# Altium schematic sheet jtag_levelxlate.SchDoc: JTAG and Level Translation
size A3; Date: DO NOT USE, RATHER USE PROJ OPTIONS; DrawnBy: DO NOT USE, RATHER USE PROJ OPTIONS; Engineer: DO NOT USE, RATHER USE PROJ OPTIONS; Organization: DO NOT USE, RATHER USE PROJ OPTIONS; DocumentNumber: DO NOT USE, RATHER USE PROJ OPTIONS; Revision: DO NOT USE, RATHER USE PROJ OPTIONS; SheetNumber: 26; SheetTotal: 27; SCH_Sheet_Filename: jtag_levelxlate.SchDoc; CurrentTime: DO NOT USE, RATHER USE PROJ OPTIONS; Time: DO NOT USE, RATHER USE PROJ OPTIONS; DocumentFullPathAndName: DO NOT USE, RATHER USE PROJ OPTIONS; DocumentName: DO NOT USE, RATHER USE PROJ OPTIONS; ModifiedDate: DO NOT USE, RATHER USE PROJ OPTIONS; ImagePath: DO NOT USE, RATHER USE PROJ OPTIONS
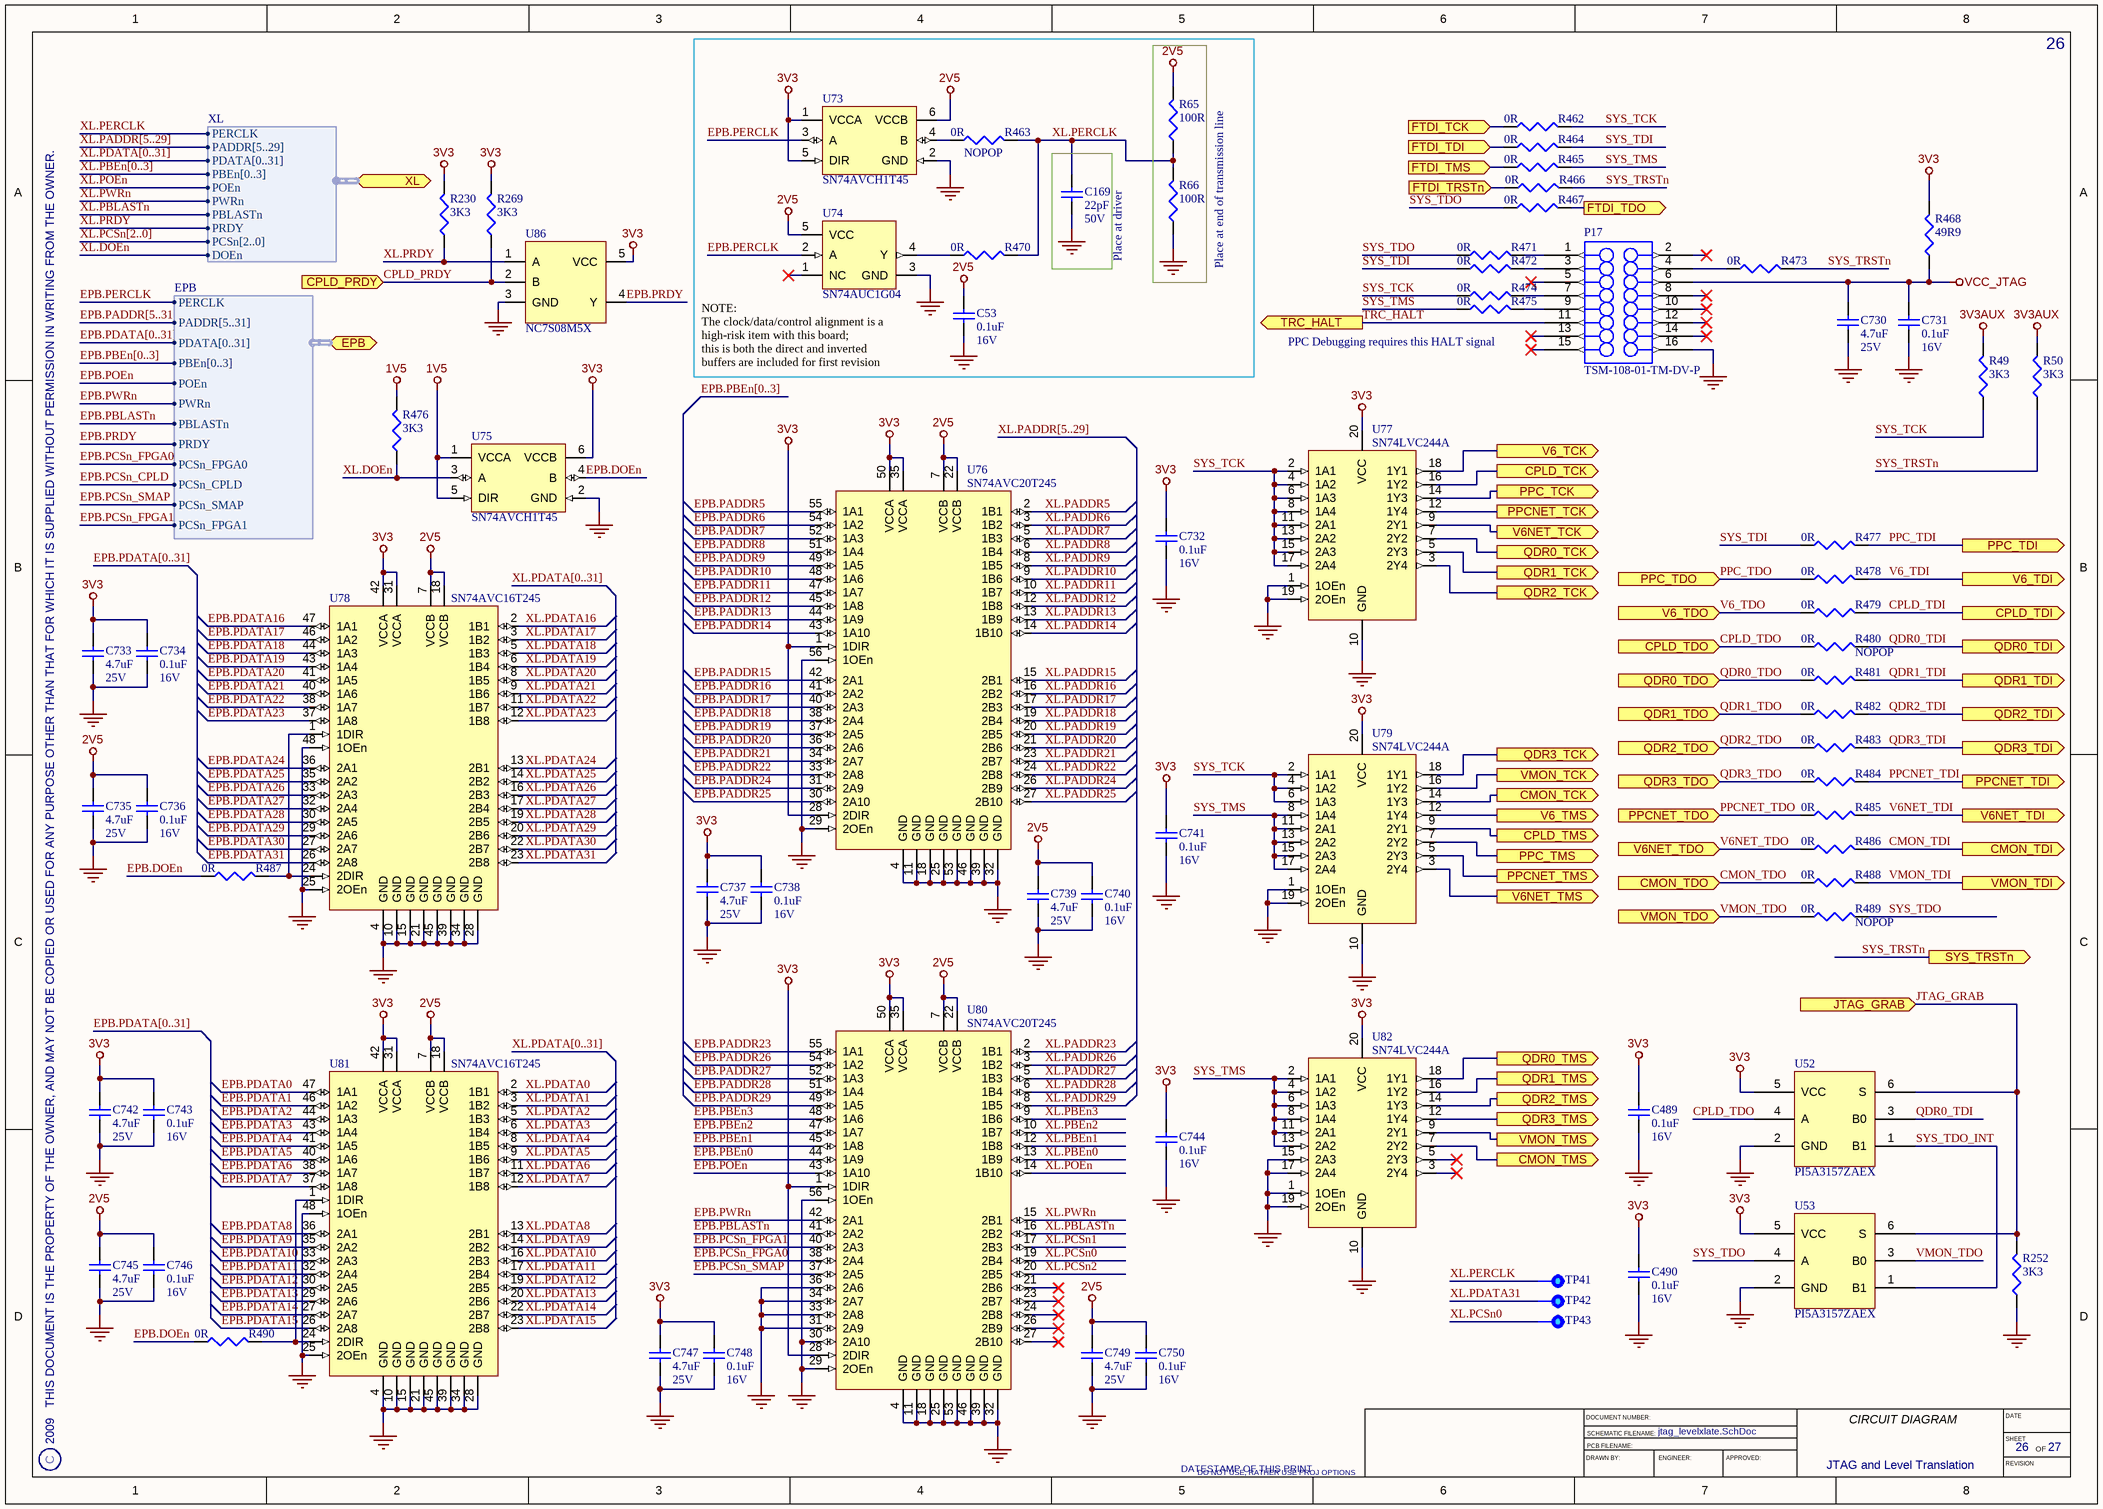
[diagram p0: jtag_levelxlate.SchDoc]

## Parts
C53  Rating: 16V  [CAPC1005X60L]  (hidden comment: 0.1uF)
C169  Rating: 50V  [CAPC1005X55L]  (hidden comment: 22pF)
C489  Rating: 16V  [CAPC1005X60L]  (hidden comment: 0.1uF)
C490  Rating: 16V  [CAPC1005X60L]  (hidden comment: 0.1uF)
C730  Rating: 25V  [CAPC2012X127L]  (hidden comment: 4.7uF)
C731  Rating: 16V  [CAPC1005X60L]  (hidden comment: 0.1uF)
C732  Rating: 16V  [CAPC1005X60L]  (hidden comment: 0.1uF)
C733  Rating: 25V  [CAPC2012X127L]  (hidden comment: 4.7uF)
C734  Rating: 16V  [CAPC1005X60L]  (hidden comment: 0.1uF)
C735  Rating: 25V  [CAPC2012X127L]  (hidden comment: 4.7uF)
C736  Rating: 16V  [CAPC1005X60L]  (hidden comment: 0.1uF)
C737  Rating: 25V  [CAPC2012X127L]  (hidden comment: 4.7uF)
C738  Rating: 16V  [CAPC1005X60L]  (hidden comment: 0.1uF)
C739  Rating: 25V  [CAPC2012X127L]  (hidden comment: 4.7uF)
C740  Rating: 16V  [CAPC1005X60L]  (hidden comment: 0.1uF)
C741  Rating: 16V  [CAPC1005X60L]  (hidden comment: 0.1uF)
C742  Rating: 25V  [CAPC2012X127L]  (hidden comment: 4.7uF)
C743  Rating: 16V  [CAPC1005X60L]  (hidden comment: 0.1uF)
C744  Rating: 16V  [CAPC1005X60L]  (hidden comment: 0.1uF)
C745  Rating: 25V  [CAPC2012X127L]  (hidden comment: 4.7uF)
C746  Rating: 16V  [CAPC1005X60L]  (hidden comment: 0.1uF)
C747  Rating: 25V  [CAPC2012X127L]  (hidden comment: 4.7uF)
C748  Rating: 16V  [CAPC1005X60L]  (hidden comment: 0.1uF)
C749  Rating: 25V  [CAPC2012X127L]  (hidden comment: 4.7uF)
C750  Rating: 16V  [CAPC1005X60L]  (hidden comment: 0.1uF)
P17  TSM-108-01-TM-DV-P  [SAMTEC_TSM-108-01-TM-DV-P]
R49  3K3  [RESC1005X40L]
R50  3K3  [RESC1005X40L]
R65  100R  [RESC1005X40L]
R66  100R  [RESC1005X40L]
R230  3K3  [RESC1005X40L]
R252  3K3  [RESC1005X40L]
R269  3K3  [RESC1005X40L]
R462  0R  [RESC1005X40L]
R463  0R  [RESC1005X40L]
R464  0R  [RESC1005X40L]
R465  0R  [RESC1005X40L]
R466  0R  [RESC1005X40L]
R467  0R  [RESC1005X40L]
R468  49R9  [RESC1005X40L]
R470  0R  [RESC1005X40L]
R471  0R  [RESC1005X40L]
R472  0R  [RESC1005X40L]
R473  0R  [RESC1005X40L]
R474  0R  [RESC1005X40L]
R475  0R  [RESC1005X40L]
R476  3K3  [RESC1005X40L]
R477  0R  [RESC1005X40L]
R478  0R  [RESC1005X40L]
R479  0R  [RESC1005X40L]
R480  0R  [RESC1005X40L]
R481  0R  [RESC1005X40L]
R482  0R  [RESC1005X40L]
R483  0R  [RESC1005X40L]
R484  0R  [RESC1005X40L]
R485  0R  [RESC1005X40L]
R486  0R  [RESC1005X40L]
R487  0R  [RESC1005X40L]
R488  0R  [RESC1005X40L]
R489  0R  [RESC1005X40L]
R490  0R  [RESC1005X40L]
TP41  Testpoint  [TP100]  (value not drawn)  (no BOM)
TP42  Testpoint  [TP100]  (value not drawn)  (no BOM)
TP43  Testpoint  [TP100]  (value not drawn)  (no BOM)
U52  PI5A3157ZAEX  [SC70-6]
U53  PI5A3157ZAEX  [SC70-6]
U73  SN74AVCH1T45  [SOT23-6]
U74  SN74AUC1G04  [SOT23-5]
U75  SN74AVCH1T45  [SOT23-6]
U76  SN74AVC20T245  [PW056]
U77  SN74LVC244A  [PW020]
U78  SN74AVC16T245  [PW048]
U79  SN74LVC244A  [PW020]
U80  SN74AVC20T245  [PW056]
U81  SN74AVC16T245  [PW048]
U82  SN74LVC244A  [PW020]
U86  NC7S08M5X  [SOT23-5]

## Ports
CMON_TCK (out), CMON_TDI (out), CMON_TDO (in), CMON_TMS (out), CPLD_PRDY (in), CPLD_TCK (out), CPLD_TDI (out), CPLD_TDO (in), CPLD_TMS (out), EPB (harness EPB), FTDI_TCK (in), FTDI_TDI (in), FTDI_TDO (out), FTDI_TMS (in), FTDI_TRSTn (in), JTAG_GRAB (in), PPC_TCK (out), PPC_TDI (out), PPC_TDO (in), PPC_TMS (out), PPCNET_TCK (out), PPCNET_TDI (out), PPCNET_TDO (in), PPCNET_TMS (out), QDR0_TCK (out), QDR0_TDI (out), QDR0_TDO (in), QDR0_TMS (out), QDR1_TCK (out), QDR1_TDI (out), QDR1_TDO (in), QDR1_TMS (out), QDR2_TCK (out), QDR2_TDI (out), QDR2_TDO (in), QDR2_TMS (out), QDR3_TCK (out), QDR3_TDI (out), QDR3_TDO (in), QDR3_TMS (out), SYS_TRSTn (out), TRC_HALT (out), V6_TCK (out), V6_TDI (out), V6_TDO (in), V6_TMS (out), V6NET_TCK (out), V6NET_TDI (out), V6NET_TDO (in), V6NET_TMS (out), VMON_TCK (out), VMON_TDI (out), VMON_TDO (in), VMON_TMS (out), XL (harness XL)

## Harnesses
EPB: PERCLK, PADDR[5..31], PDATA[0..31], PBEn[0..3], POEn, PWRn, PBLASTn, PRDY, PCSn_FPGA0, PCSn_CPLD, PCSn_SMAP, PCSn_FPGA1
XL: PERCLK, PADDR[5..29], PDATA[0..31], PBEn[0..3], POEn, PWRn, PBLASTn, PRDY, PCSn[2..0], DOEn

## Nets
1V5: R476.2 U75.1(VCCA) U75.5(DIR)
2V5: C53.2 C735.2 C736.2 C739.2 C740.2 C745.2 C746.2 C749.2 C750.2 R65.2 U73.6(VCCB) U74.5(VCC) U76.7(VCCB) U76.22(VCCB) U78.7(VCCB) U78.18(VCCB) U80.7(VCCB) U80.22(VCCB) U81.7(VCCB) U81.18(VCCB)
3V3: C489.2 C490.2 C732.2 C733.2 C734.2 C737.2 C738.2 C741.2 C742.2 C743.2 C744.2 C747.2 C748.2 R230.2 R269.2 R468.2 U52.5(VCC) U53.5(VCC) U73.1(VCCA) U73.5(DIR) U75.6(VCCB) U76.1(1DIR) U76.28(2DIR) U76.35(VCCA) U76.50(VCCA) U77.20(VCC) U78.31(VCCA) U78.42(VCCA) U79.20(VCC) U80.1(1DIR) U80.28(2DIR) U80.35(VCCA) U80.50(VCCA) U81.31(VCCA) U81.42(VCCA) U82.20(VCC) U86.5(VCC)
3V3AUX: R49.2 R50.2
GND: C53.1 C169.1 C489.1 C490.1 C730.1 C731.1 C732.1 C733.1 C734.1 C735.1 C736.1 C737.1 C738.1 C739.1 C740.1 C741.1 C742.1 C743.1 C744.1 C745.1 C746.1 C747.1 C748.1 C749.1 C750.1 P17.16(B16) R66.1 R252.1 U52.2(GND) U53.2(GND) U73.2(GND) U74.3(GND) U75.2(GND) U76.4(GND) U76.11(GND) U76.18(GND) U76.25(GND) U76.29(2OEn) U76.32(GND) U76.39(GND) U76.46(GND) U76.53(GND) U76.56(1OEn) U77.1(1OEn) U77.10(GND) U77.19(2OEn) U78.4(GND) U78.10(GND) U78.15(GND) U78.21(GND) U78.25(2OEn) U78.28(GND) U78.34(GND) U78.39(GND) U78.45(GND) U78.48(1OEn) U79.1(1OEn) U79.10(GND) U79.19(2OEn) U80.4(GND) U80.11(GND) U80.18(GND) U80.25(GND) U80.29(2OEn) U80.30(2A10) U80.31(2A9) U80.32(GND) U80.33(2A8) U80.34(2A7) U80.36(2A6) U80.39(GND) U80.46(GND) U80.53(GND) U80.56(1OEn) U81.4(GND) U81.10(GND) U81.15(GND) U81.21(GND) U81.25(2OEn) U81.28(GND) U81.34(GND) U81.39(GND) U81.45(GND) U81.48(1OEn) U82.1(1OEn) U82.10(GND) U82.15(2A3) U82.17(2A4) U82.19(2OEn) U86.3(GND)
VCC_JTAG: C730.2 C731.2 P17.6(B6) R468.1
CMON_TCK: U79.14(1Y3) ; port CMON_TCK
CMON_TDI: R486.2 ; port CMON_TDI
CMON_TDO: R488.1 ; port CMON_TDO
CMON_TMS: U82.7(2Y2) ; port CMON_TMS
CPLD_PRDY: R269.1 U86.2(B) ; port CPLD_PRDY
CPLD_TCK: U77.16(1Y2) ; port CPLD_TCK
CPLD_TDI: R479.2 ; port CPLD_TDI
CPLD_TDO: R480.1 U52.4(A) ; port CPLD_TDO
CPLD_TMS: U79.9(2Y1) ; port CPLD_TMS
EPB.DOEn: R487.1 R490.1 U75.4(B)
EPB.PADDR5: U76.55(1A1)
EPB.PADDR6: U76.54(1A2)
EPB.PADDR7: U76.52(1A3)
EPB.PADDR8: U76.51(1A4)
EPB.PADDR9: U76.49(1A5)
EPB.PADDR10: U76.48(1A6)
EPB.PADDR11: U76.47(1A7)
EPB.PADDR12: U76.45(1A8)
EPB.PADDR13: U76.44(1A9)
EPB.PADDR14: U76.43(1A10)
EPB.PADDR15: U76.42(2A1)
EPB.PADDR16: U76.41(2A2)
EPB.PADDR17: U76.40(2A3)
EPB.PADDR18: U76.38(2A4)
EPB.PADDR19: U76.37(2A5)
EPB.PADDR20: U76.36(2A6)
EPB.PADDR21: U76.34(2A7)
EPB.PADDR22: U76.33(2A8)
EPB.PADDR23: U80.55(1A1)
EPB.PADDR24: U76.31(2A9)
EPB.PADDR25: U76.30(2A10)
EPB.PADDR26: U80.54(1A2)
EPB.PADDR27: U80.52(1A3)
EPB.PADDR28: U80.51(1A4)
EPB.PADDR29: U80.49(1A5)
EPB.PBEn0: U80.44(1A9)
EPB.PBEn1: U80.45(1A8)
EPB.PBEn2: U80.47(1A7)
EPB.PBEn3: U80.48(1A6)
EPB.PBLASTn: U80.41(2A2) ; port EPB.PBLASTn
EPB.PCSn_CPLD: port EPB.PCSn_CPLD
EPB.PCSn_FPGA0: U80.38(2A4) ; port EPB.PCSn_FPGA0
EPB.PCSn_FPGA1: U80.40(2A3) ; port EPB.PCSn_FPGA1
EPB.PCSn_SMAP: U80.37(2A5) ; port EPB.PCSn_SMAP
EPB.PDATA0: U81.47(1A1)
EPB.PDATA1: U81.46(1A2)
EPB.PDATA2: U81.44(1A3)
EPB.PDATA3: U81.43(1A4)
EPB.PDATA4: U81.41(1A5)
EPB.PDATA5: U81.40(1A6)
EPB.PDATA6: U81.38(1A7)
EPB.PDATA7: U81.37(1A8)
EPB.PDATA8: U81.36(2A1)
EPB.PDATA9: U81.35(2A2)
EPB.PDATA10: U81.33(2A3)
EPB.PDATA11: U81.32(2A4)
EPB.PDATA12: U81.30(2A5)
EPB.PDATA13: U81.29(2A6)
EPB.PDATA14: U81.27(2A7)
EPB.PDATA15: U81.26(2A8)
EPB.PDATA16: U78.47(1A1)
EPB.PDATA17: U78.46(1A2)
EPB.PDATA18: U78.44(1A3)
EPB.PDATA19: U78.43(1A4)
EPB.PDATA20: U78.41(1A5)
EPB.PDATA21: U78.40(1A6)
EPB.PDATA22: U78.38(1A7)
EPB.PDATA23: U78.37(1A8)
EPB.PDATA24: U78.36(2A1)
EPB.PDATA25: U78.35(2A2)
EPB.PDATA26: U78.33(2A3)
EPB.PDATA27: U78.32(2A4)
EPB.PDATA28: U78.30(2A5)
EPB.PDATA29: U78.29(2A6)
EPB.PDATA30: U78.27(2A7)
EPB.PDATA31: U78.26(2A8)
EPB.PERCLK: U73.3(A) U74.2(A) ; port EPB.PERCLK
EPB.POEn: U80.43(1A10) ; port EPB.POEn
EPB.PRDY: U86.4(Y) ; port EPB.PRDY
EPB.PWRn: U80.42(2A1) ; port EPB.PWRn
FTDI_TCK: R462.1 ; port FTDI_TCK
FTDI_TDI: R464.1 ; port FTDI_TDI
FTDI_TDO: R467.2 ; port FTDI_TDO
FTDI_TMS: R465.1 ; port FTDI_TMS
FTDI_TRSTn: R466.1 ; port FTDI_TRSTn
JTAG_GRAB: R252.2 U52.6(S) U53.6(S) ; port JTAG_GRAB
PPC_TCK: U77.14(1Y3) ; port PPC_TCK
PPC_TDI: R477.2 ; port PPC_TDI
PPC_TDO: R478.1 ; port PPC_TDO
PPC_TMS: U79.7(2Y2) ; port PPC_TMS
PPCNET_TCK: U77.12(1Y4) ; port PPCNET_TCK
PPCNET_TDI: R484.2 ; port PPCNET_TDI
PPCNET_TDO: R485.1 ; port PPCNET_TDO
PPCNET_TMS: U79.5(2Y3) ; port PPCNET_TMS
QDR0_TCK: U77.7(2Y2) ; port QDR0_TCK
QDR0_TDI: R480.2 U52.3(B0) ; port QDR0_TDI
QDR0_TDO: R481.1 ; port QDR0_TDO
QDR0_TMS: U82.18(1Y1) ; port QDR0_TMS
QDR1_TCK: U77.5(2Y3) ; port QDR1_TCK
QDR1_TDI: R481.2 ; port QDR1_TDI
QDR1_TDO: R482.1 ; port QDR1_TDO
QDR1_TMS: U82.16(1Y2) ; port QDR1_TMS
QDR2_TCK: U77.3(2Y4) ; port QDR2_TCK
QDR2_TDI: R482.2 ; port QDR2_TDI
QDR2_TDO: R483.1 ; port QDR2_TDO
QDR2_TMS: U82.14(1Y3) ; port QDR2_TMS
QDR3_TCK: U79.18(1Y1) ; port QDR3_TCK
QDR3_TDI: R483.2 ; port QDR3_TDI
QDR3_TDO: R484.1 ; port QDR3_TDO
QDR3_TMS: U82.12(1Y4) ; port QDR3_TMS
SYS_TCK: R49.1 R462.2 R474.1 U77.2(1A1) U77.4(1A2) U77.6(1A3) U77.8(1A4) U77.11(2A1) U77.13(2A2) U77.15(2A3) U77.17(2A4) U79.2(1A1) U79.4(1A2) U79.6(1A3)
SYS_TDI: R464.2 R472.1 R477.1
SYS_TDO: R467.1 R471.1 R489.2 U53.4(A)
SYS_TDO_INT: U52.1(B1) U53.1(B1)
SYS_TMS: R465.2 R475.1 U79.8(1A4) U79.11(2A1) U79.13(2A2) U79.15(2A3) U79.17(2A4) U82.2(1A1) U82.4(1A2) U82.6(1A3) U82.8(1A4) U82.11(2A1) U82.13(2A2)
SYS_TRSTn: R50.1 R466.2 R473.2 ; port SYS_TRSTn
TRC_HALT: P17.11(A11) ; port TRC_HALT
V6_TCK: U77.18(1Y1) ; port V6_TCK
V6_TDI: R478.2 ; port V6_TDI
V6_TDO: R479.1 ; port V6_TDO
V6_TMS: U79.12(1Y4) ; port V6_TMS
V6NET_TCK: U77.9(2Y1) ; port V6NET_TCK
V6NET_TDI: R485.2 ; port V6NET_TDI
V6NET_TDO: R486.1 ; port V6NET_TDO
V6NET_TMS: U79.3(2Y4) ; port V6NET_TMS
VMON_TCK: U79.16(1Y2) ; port VMON_TCK
VMON_TDI: R488.2 ; port VMON_TDI
VMON_TDO: R489.1 U53.3(B0) ; port VMON_TDO
VMON_TMS: U82.9(2Y1) ; port VMON_TMS
XL.DOEn: R476.1 U75.3(A) ; port XL.DOEn
XL.PADDR5: U76.2(1B1)
XL.PADDR6: U76.3(1B2)
XL.PADDR7: U76.5(1B3)
XL.PADDR8: U76.6(1B4)
XL.PADDR9: U76.8(1B5)
XL.PADDR10: U76.9(1B6)
XL.PADDR11: U76.10(1B7)
XL.PADDR12: U76.12(1B8)
XL.PADDR13: U76.13(1B9)
XL.PADDR14: U76.14(1B10)
XL.PADDR15: U76.15(2B1)
XL.PADDR16: U76.16(2B2)
XL.PADDR17: U76.17(2B3)
XL.PADDR18: U76.19(2B4)
XL.PADDR19: U76.20(2B5)
XL.PADDR20: U76.21(2B6)
XL.PADDR21: U76.23(2B7)
XL.PADDR22: U76.24(2B8)
XL.PADDR23: U80.2(1B1)
XL.PADDR24: U76.26(2B9)
XL.PADDR25: U76.27(2B10)
XL.PADDR26: U80.3(1B2)
XL.PADDR27: U80.5(1B3)
XL.PADDR28: U80.6(1B4)
XL.PADDR29: U80.8(1B5)
XL.PBEn0: U80.13(1B9)
XL.PBEn1: U80.12(1B8)
XL.PBEn2: U80.10(1B7)
XL.PBEn3: U80.9(1B6)
XL.PBLASTn: U80.16(2B2) ; port XL.PBLASTn
XL.PCSn0: TP43.1 U80.19(2B4)
XL.PCSn1: U80.17(2B3)
XL.PCSn2: U80.20(2B5)
XL.PDATA0: U81.2(1B1)
XL.PDATA1: U81.3(1B2)
XL.PDATA2: U81.5(1B3)
XL.PDATA3: U81.6(1B4)
XL.PDATA4: U81.8(1B5)
XL.PDATA5: U81.9(1B6)
XL.PDATA6: U81.11(1B7)
XL.PDATA7: U81.12(1B8)
XL.PDATA8: U81.13(2B1)
XL.PDATA9: U81.14(2B2)
XL.PDATA10: U81.16(2B3)
XL.PDATA11: U81.17(2B4)
XL.PDATA12: U81.19(2B5)
XL.PDATA13: U81.20(2B6)
XL.PDATA14: U81.22(2B7)
XL.PDATA15: U81.23(2B8)
XL.PDATA16: U78.2(1B1)
XL.PDATA17: U78.3(1B2)
XL.PDATA18: U78.5(1B3)
XL.PDATA19: U78.6(1B4)
XL.PDATA20: U78.8(1B5)
XL.PDATA21: U78.9(1B6)
XL.PDATA22: U78.11(1B7)
XL.PDATA23: U78.12(1B8)
XL.PDATA24: U78.13(2B1)
XL.PDATA25: U78.14(2B2)
XL.PDATA26: U78.16(2B3)
XL.PDATA27: U78.17(2B4)
XL.PDATA28: U78.19(2B5)
XL.PDATA29: U78.20(2B6)
XL.PDATA30: U78.22(2B7)
XL.PDATA31: TP42.1 U78.23(2B8)
XL.PERCLK: C169.2 R65.1 R66.2 R463.2 R470.2 TP41.1 ; port XL.PERCLK
XL.POEn: U80.14(1B10) ; port XL.POEn
XL.PRDY: R230.1 U86.1(A) ; port XL.PRDY
XL.PWRn: U80.15(2B1) ; port XL.PWRn
NetP17_1: P17.1(A1) R471.2
NetP17_3: P17.3(A3) R472.2
NetP17_4: P17.4(B4) R473.1
NetP17_7: P17.7(A7) R474.2
NetP17_9: P17.9(A9) R475.2
NetR463_1: R463.1 U73.4(B)
NetR470_1: R470.1 U74.4(Y)
NetR487_2: R487.2 U78.1(1DIR) U78.24(2DIR)
NetR490_2: R490.2 U81.1(1DIR) U81.24(2DIR)

Not connected (* = marked no-connect by the designer): P17 2(B2)* 5(A5)* 8(B8)* 10(B10)* 12(B12)* 13(A13)* 14(B14)* 15(A15)*; U74 1(NC)*; U80 21(2B6)* 23(2B7)* 24(2B8)* 26(2B9)* 27(2B10)*; U82 3(2Y4)* 5(2Y3)*

## Buses and harness runs
bus EPB.PADDR[5..31]
bus EPB.PBEn[0..3]
bus EPB.PDATA[0..31]
bus XL.PADDR[5..29]
bus XL.PBEn[0..3]
bus XL.PCSn[2..0]
bus XL.PDATA[0..31]

## Notes on the sheet
- (near R463) NOPOP
- Place at driver
- Place at end of transmission line
- (near U74) NOTE:
  The clock/data/control alignment is a
  high-risk item with this board;
  this is both the direct and inverted
  buffers are included for first revision
- PPC Debugging requires this HALT signal
- (near R480) NOPOP
- (near R489) NOPOP
- 2009   THIS DOCUMENT IS THE PROPERTY OF THE OWNER, AND MAY NOT BE COPIED OR USED FOR ANY PURPOSE OTHER THAN THAT FOR WHICH IT IS SUPPLIED WITHOUT PERMISSION IN WRITING FROM THE OWNER.
- C
- DATESTAMP OF THIS PRINT
- DRAWN BY:
- DOCUMENT NUMBER:
- SCHEMATIC FILENAME:
- PCB FILENAME:
- ENGINEER:
- APPROVED:
- CIRCUIT DIAGRAM
- DATE
- SHEET
- REVISION
- OF

## Library data of the parts
C53 C489 C490 C731 C732 C734 C736 C738 C740 C741 C743 C744 C746 C748 C750 = CAP-CER-1: 0.1uF, Ceramic Capacitor; Manufacturer: VENKEL; PartNum: C0402X7R160-104KN; Tolerance: 10%; Dielectric: X7R; POD number: CAP-CER-1; Value: 0.1uF; RoHS: Y; Sort Value: 0.1; Category: Capacitors; Subcategory: Ceramic
C169 = CAP-CER-2: 22pF, Ceramic Capacitor; Manufacturer: MURATA; PartNum: GRM1555C1H220JZ01D; Tolerance: 5%; Dielectric: C0G; POD number: CAP-CER-2; Value: 22pF; RoHS: Y; Sort Value: 0.000022; Category: Capacitors; Subcategory: Ceramic
C730 C733 C735 C737 C739 C742 C745 C747 C749 = CAP-CER-3: 4.7uF, Ceramic Capacitor; Manufacturer: MURATA; PartNum: GRM21BR61E475KA12K; Tolerance: 10%; Dielectric: X5R; POD number: CAP-CER-3; Value: 4.7uF; RoHS: Y; Sort Value: 4.7; Category: Capacitors; Subcategory: Ceramic
P17 = CONN-PCB-11: 2x8, 2.54 mm Pitch, Male Header; Manufacturer: SAMTEC; POD number: CONN-PCB-11; PartNum: TSM-108-01-TM-DV-P; RoHS: Y; Category: CONN; Subcategory: PCB
R49 R50 R230 R252 R269 R476 = RES-TF-7: 3K3, 1.1mm x 0.5mm, Thick Film Resistor; Manufacturer: ROYALOHM; PartNum: 0402WGJ0332T1E; Tolerance: 5%; Rating: 0.0625W; POD number: RES-TF-7; Value: 3K3; Sort Value: 3300; Category: Resistors; Subcategory: ThickFilm; HelpURL: *.pdf
R65 R66 = RES-TF-14: 100R, 1.1mm x 0.5mm, Thick Film Resistor; Manufacturer: ROYALOHM; PartNum: 0402WGF0101T1E; Tolerance: 1%; Rating: 0.0625W; POD number: RES-TF-14; Value: 100R; Sort Value: 100; Category: Resistors; Subcategory: ThickFilm; HelpURL: http://www.royalohm.com/pdf/general.pdf
R462-R467 R470-R475 R477-R490 = RES-TF-0: 0R, 1.1mm x 0.5mm, Thick Film Resistor; Manufacturer: ROYALOHM; PartNum: 0402WG00000T1E; Tolerance: 0%; Rating: 0.0625W; POD number: RES-TF-0; Value: 0R; Sort Value: 0; Category: Resistors; Subcategory: ThickFilm; HelpURL: *.pdf
R468 = RES-TF-10: 49R9, 1.1mm x 0.5mm, Thick Film Resistor; Manufacturer: ROYALOHM; PartNum: 0402WGF499JT1E; Tolerance: 1%; Rating: 0.0625W; POD number: RES-TF-10; Value: 49R9; Sort Value: 49.9; Category: Resistors; Subcategory: ThickFilm; HelpURL: *.pdf
TP41-TP43 = ELMECH-TP-0: 1mm Diameter, through-hole, Circular Test-point; POD number: ELMECH-TP-0; RoHS: Y; Category: ELMECH; Subcategory: Test Points
U52 U53 = IC-LOG-5: Low voltage SPDT Analogue Switch; Manufacturer: PERICOM; POD number: IC-LOG-5; PartNum: PI5A3157ZAEX; RoHS: Y; Category: IC; Subcategory: Logic
U73 U75 = IC-LOG-13: Single-Bit Dual Supply Bus Transceiver with Configurable Voltage Translation and 3-State Outputs; Manufacturer: Texas Instruments; POD number: IC-LOG-13; PartNum: SN74AVCH1T45; RoHS: Y; Category: IC; Subcategory: Logic
U74 = IC-LOG-1: Single Inverter Gate; Manufacturer: Texas Instruments; POD number: IC-LOG-1; PartNum: SN74AUC1G04; RoHS: Y; Category: IC; Subcategory: Logic
U76 U80 = IC-LOG-12: 20-Bit Dual-Supply Bus Transceivers with Configurable Voltage Translation and 3-State Outputs; Manufacturer: Texas Instruments; POD number: IC-LOG-12; PartNum: SN74AVC20T245; RoHS: Y; Category: IC; Subcategory: Logic
U77 U79 U82 = IC-LOG-4: Octal Buffer/Drive with 3-State Outputs; Manufacturer: Texas Instruments; POD number: IC-LOG-4; PartNum: SN74LVC244A; RoHS: Y; Category: IC; Subcategory: Logic
U78 U81 = IC-LOG-11: 16-BIT DUAL-SUPPLY BUS TRANSCEIVER WITH CONFIGURABLE VOLTAGE TRANSLATION AND 3-STATE OUTPUTS; Manufacturer: Texas Instruments; POD number: IC-LOG-11; PartNum: SN74AVC16T245; RoHS: Y; Category: IC; Subcategory: Logic
U86 = IC-LOG-0: TinyLogic® HS 2-Input AND Gate; Manufacturer: Fairchild Semiconductor; POD number: IC-LOG-0; PartNum: NC7S08M5X; RoHS: Y; Category: IC; Subcategory: Logic